# Altium schematic sheet Controller.SchDoc: Controller
size A3; Organization: Hofmann Travel; SheetNumber: 2; SheetTotal: 10
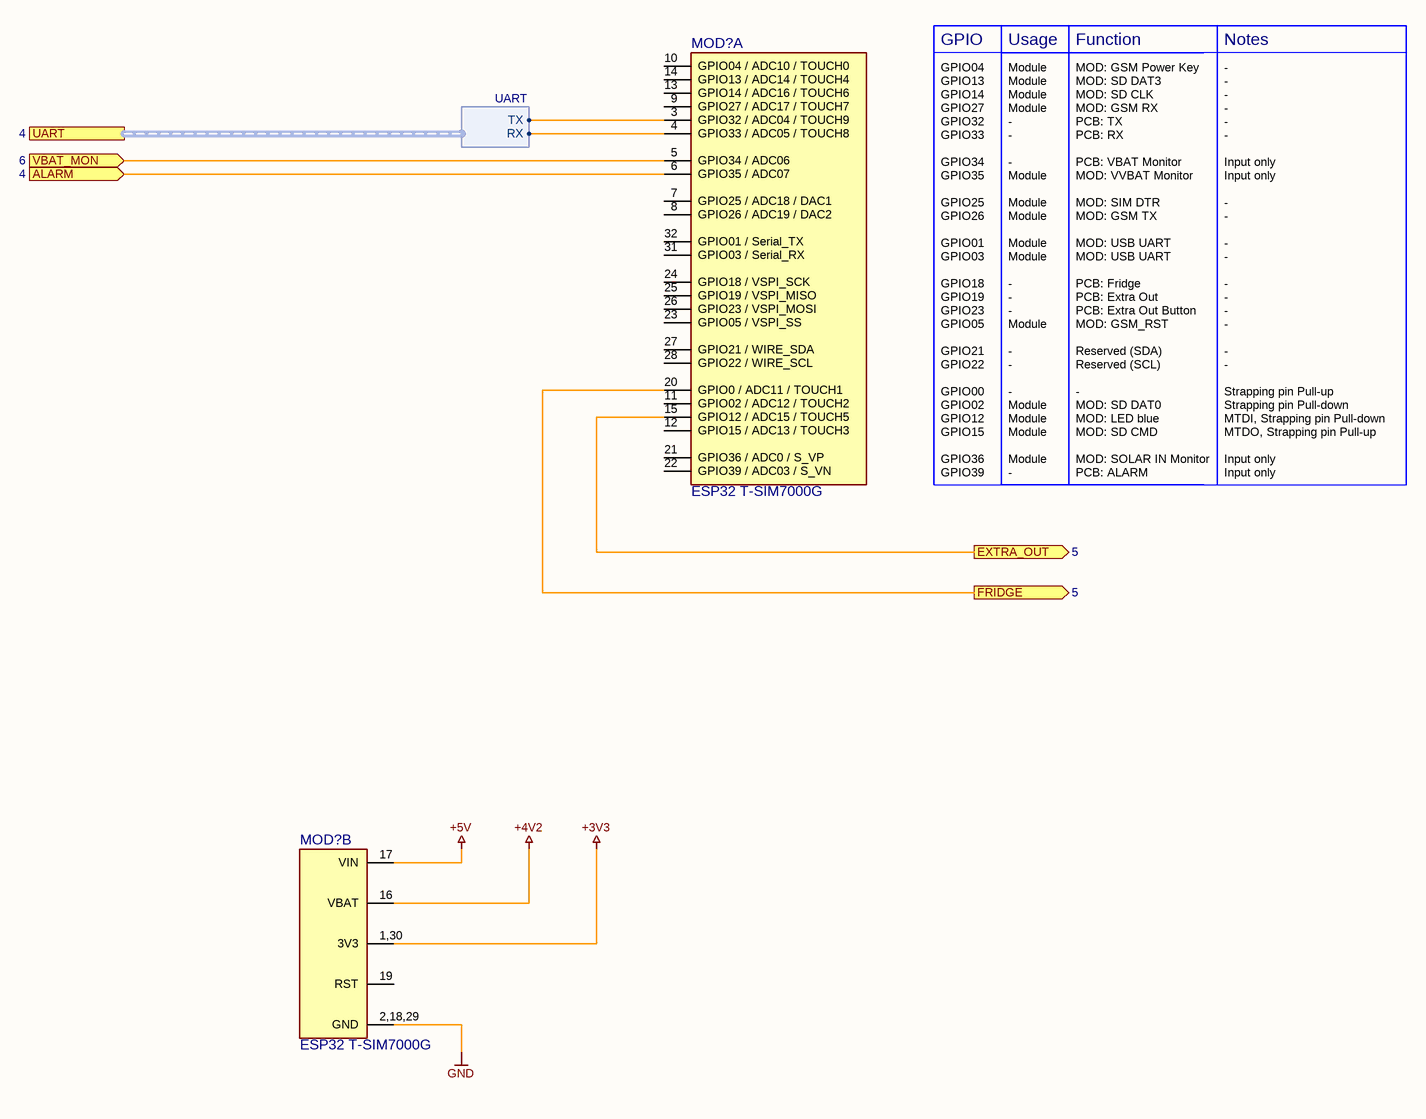
[diagram p0: Controller.SchDoc]

## Parts
(Parts that share a designator on the sheet are numbered #1, #2 ... from top to bottom, then left to right.)
MOD?#1  ESP32 T-SIM7000G  [ESP32-T-SIM7000G]  (part A of 2)
MOD?#2  ESP32 T-SIM7000G  [ESP32-T-SIM7000G]  (part B of 2)

## Ports
ALARM (in, see 4), EXTRA_OUT (out, see 5), FRIDGE (out, see 5), UART (harness UART, see 4), VBAT_MON (in, see 6)

## Harnesses
UART: TX, RX

## Nets
+3V3: MOD?#2.1,30(3V3)
+4V2: MOD?#2.16(VBAT)
+5V: MOD?#2.17(VIN)
GND: MOD?#2.2,18,29(GND)
ALARM: MOD?#1.6(GPIO35_/_ADC07) ; port ALARM
EXTRA_OUT: MOD?#1.15(GPIO12_/_ADC15_/_TOUCH5) ; port EXTRA_OUT
FRIDGE: MOD?#1.20(GPIO0_/_ADC11_/_TOUCH1) ; port FRIDGE
VBAT_MON: MOD?#1.5(GPIO34_/_ADC06) ; port VBAT_MON
NetMOD?#1_3: MOD?#1.3(GPIO32_/_ADC04_/_TOUCH9) ; port UART.TX
NetMOD?#1_4: MOD?#1.4(GPIO33_/_ADC05_/_TOUCH8) ; port UART.RX

Not connected (* = marked no-connect by the designer): MOD?#1 7(GPIO25_/_ADC18_/_DAC1) 8(GPIO26_/_ADC19_/_DAC2) 9(GPIO27_/_ADC17_/_TOUCH7) 10(GPIO04_/_ADC10_/_TOUCH0) 11(GPIO02_/_ADC12_/_TOUCH2) 12(GPIO15_/_ADC13_/_TOUCH3) 13(GPIO14_/_ADC16_/_TOUCH6) 14(GPIO13_/_ADC14_/_TOUCH4) 21(GPIO36_/_ADC0_/_S_VP) 22(GPIO39_/_ADC03_/_S_VN) 23(GPIO05_/_VSPI_SS) 24(GPIO18_/_VSPI_SCK) 25(GPIO19_/_VSPI_MISO) 26(GPIO23_/_VSPI_MOSI) 27(GPIO21_/_WIRE_SDA) 28(GPIO22_/_WIRE_SCL) 31(GPIO03_/_Serial_RX) 32(GPIO01_/_Serial_TX); MOD?#2 19(RST)

## Notes on the sheet
- GPIO
- Usage
- Function
- Notes
- GPIO04
  GPIO13
  GPIO14
  GPIO27
  GPIO32
  GPIO33
  GPIO34
  GPIO35
  GPIO25
  GPIO26
  GPIO01
  GPIO03
  GPIO18
  GPIO19
  GPIO23
  GPIO05
  GPIO21
  GPIO22
  GPIO00
  GPIO02
  GPIO12
  GPIO15
  GPIO36
  GPIO39
- Module
  Module
  Module
  Module
  -
  -
  -
  Module
  Module
  Module
  Module
  Module
  -
  -
  -
  Module
  -
  -
  -
  Module
  Module
  Module
  Module
  -
- GSM Power Key
  SD DAT3
  SD CLK
  GSM RX
  -
  -
  -
  VVBAT Monitor
  SIM DTR
  GSM TX
  USB UART
  USB UART
  -
  -
  -
  GSM_RST
  -
  -
  -
  SD DAT0
  LED blue
  SD CMD
  SOLAR IN Monitor
  -
- MOD: GSM Power Key
  MOD: SD DAT3
  MOD: SD CLK
  MOD: GSM RX
  PCB: TX
  PCB: RX
  PCB: VBAT Monitor
  MOD: VVBAT Monitor
  MOD: SIM DTR
  MOD: GSM TX
  MOD: USB UART
  MOD: USB UART
  PCB: Fridge
  PCB: Extra Out
  PCB: Extra Out Button
  MOD: GSM_RST
  Reserved (SDA)
  Reserved (SCL)
  -
  MOD: SD DAT0
  MOD: LED blue
  MOD: SD CMD
  MOD: SOLAR IN Monitor
  PCB: ALARM
- -
  -
  -
  -
  -
  -
  Input only
  Input only
  -
  -
  -
  -
  -
  -
  -
  -
  -
  -
  Strapping pin Pull-up
  Strapping pin Pull-down
  MTDI, Strapping pin Pull-down
  MTDO, Strapping pin Pull-up
  Input only
  Input only
- Date:
- Size:
- A3
- Schema:
- Layout:

## Library data of the parts
MOD?#1 MOD?#2 = ESP32 T-SIM7000G: ESP32 T-SIM7000G ESP32 SIM Card T-SIM7000G module; Manufacturer: Xinyuan LilyGO; Part Number: ESP32 T-SIM7000G; Package: Module; HelpURL: https://github.com/Xinyuan-LilyGO/LilyGO-T-SIM7000G; Manufacturer 1: Xinyuan LilyGO